# Altium schematic sheet 13 Processor Power Deco.SchDoc
size 420 x 297 mm
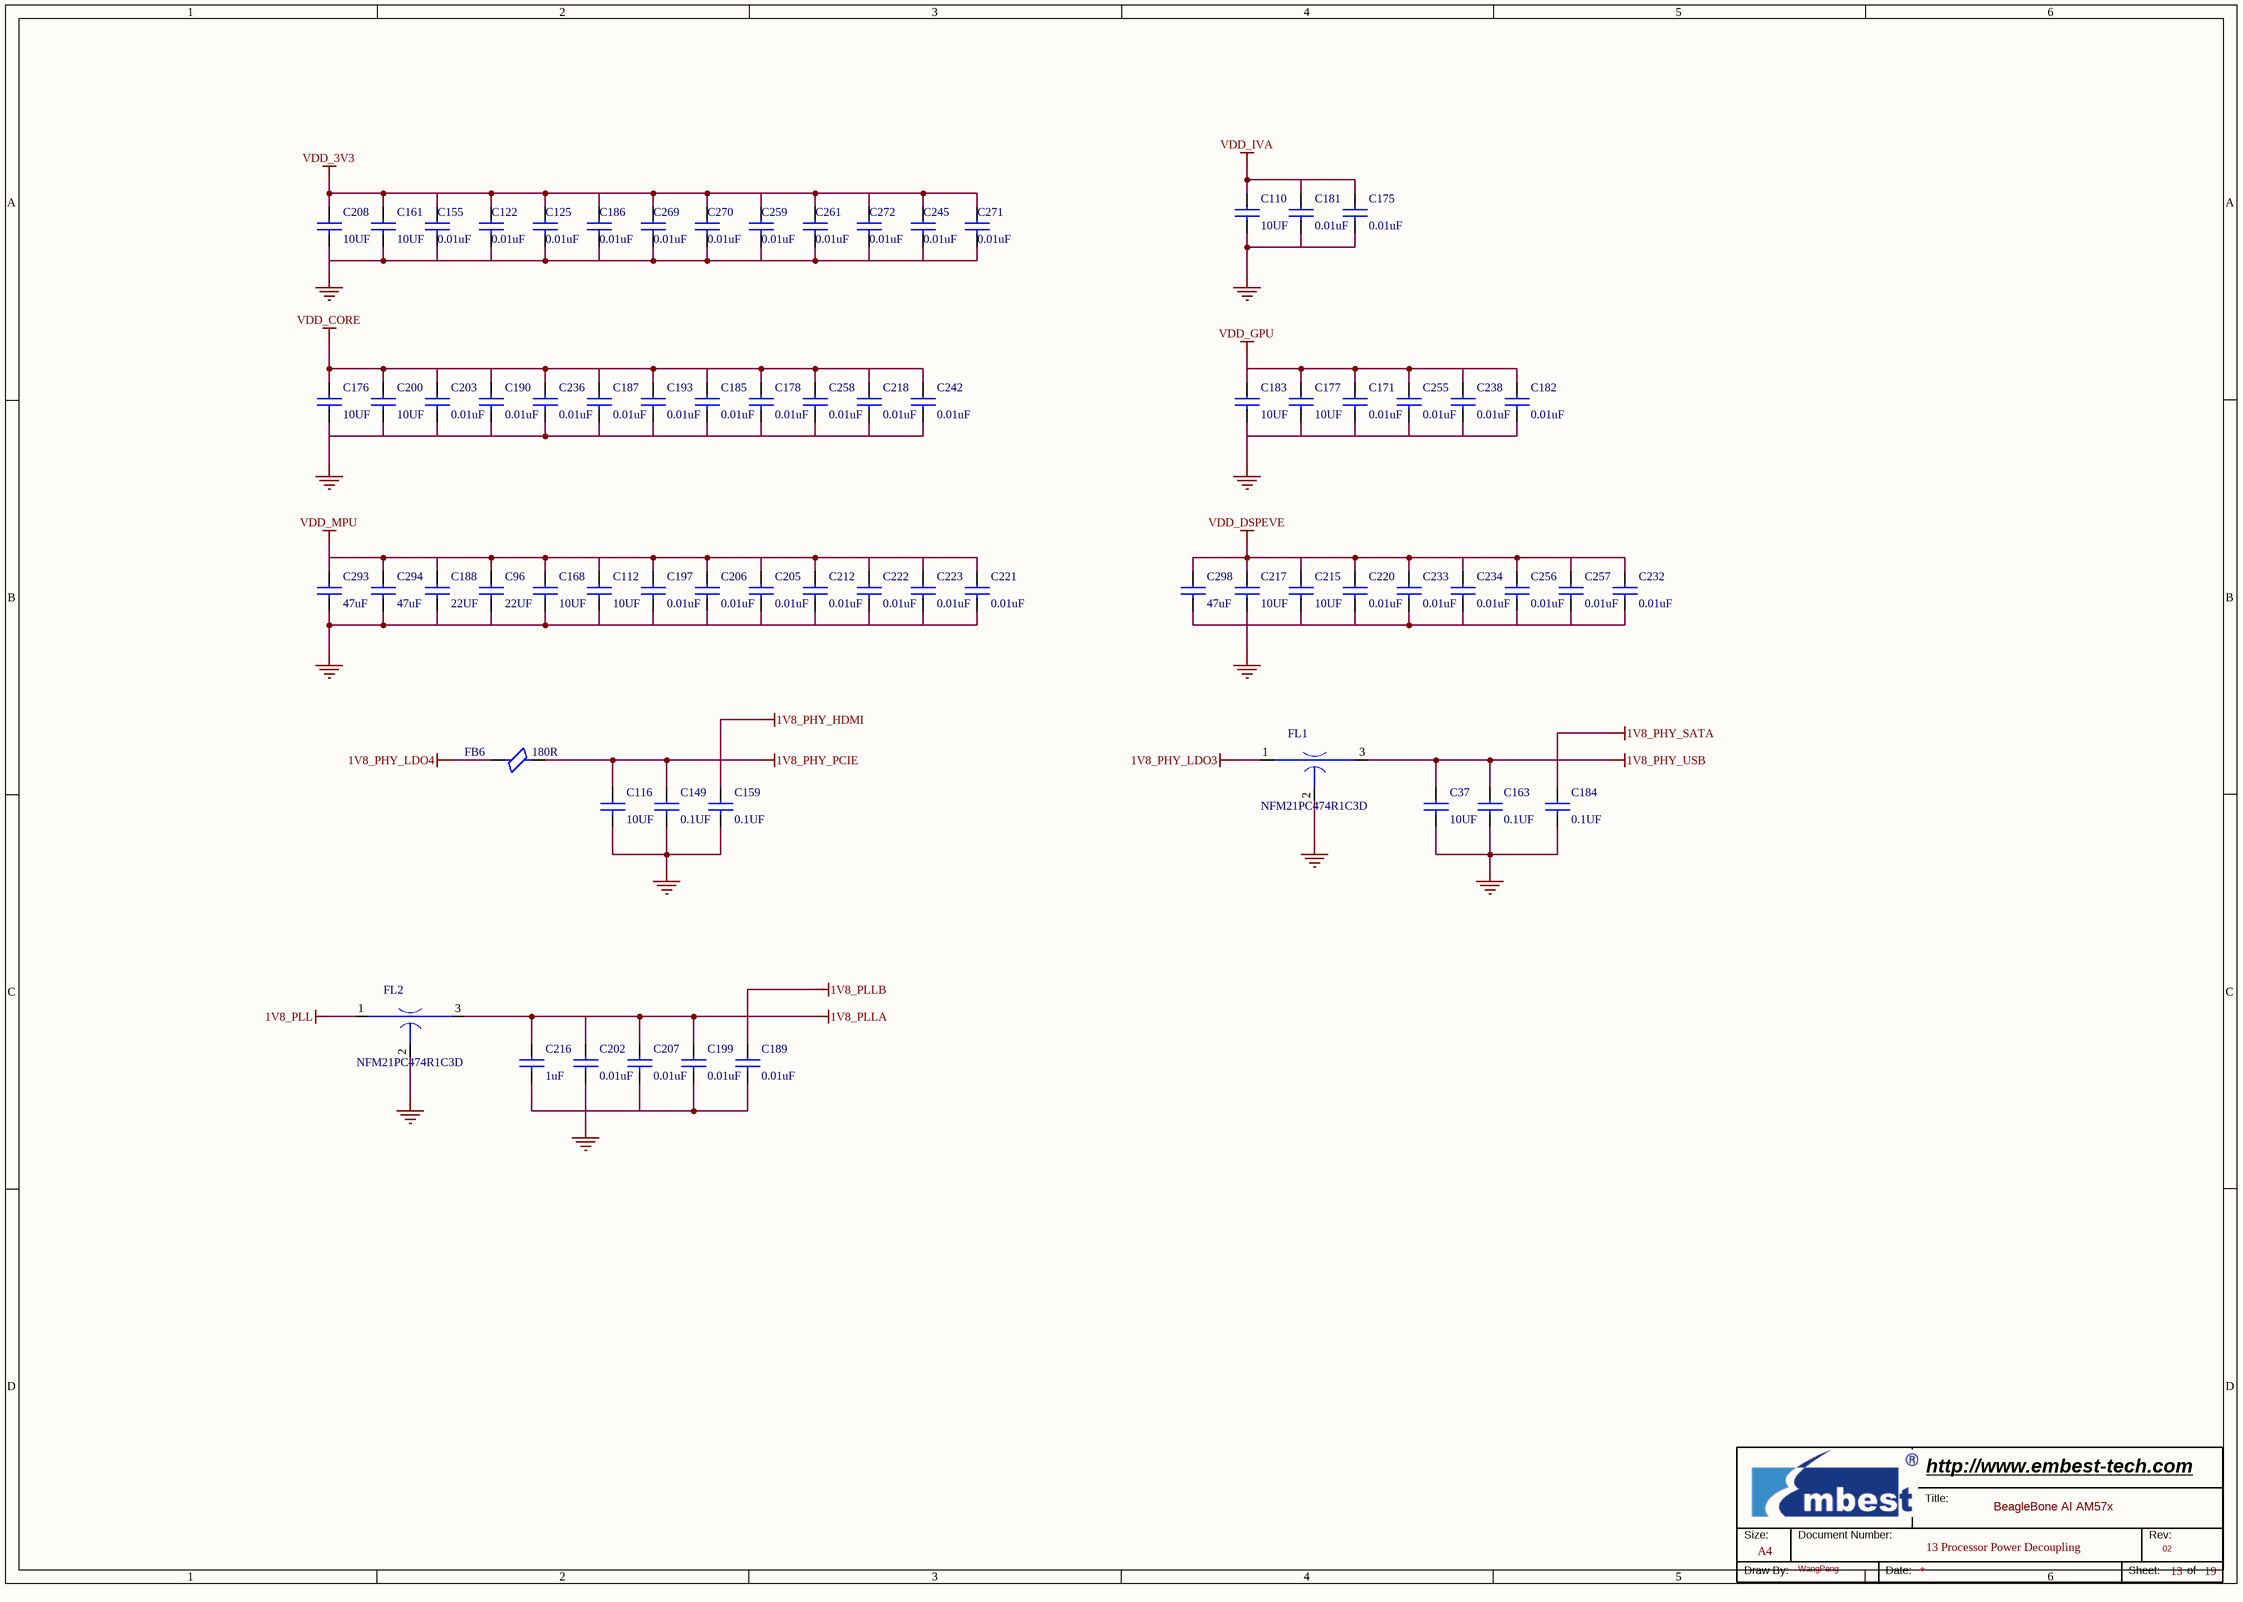
[diagram p0: 13 Processor Power Deco.SchDoc]

## Parts
*  Page Count: 19  Page Number: 13  Page Size: A4  Title: BeagleBone AI AM57x  RevCode: 02  Doc: 13 Processor Power Decoupling  Drawing: WangPeng  (hidden comment: Embest Title)  (graphical)
C37  10UF  [C0603]
C96  22UF  [C0603]
C110  10UF  [C0402]
C112  10UF  [C0402]
C116  10UF  [C0603]
C122  0.01uF  [C0402]
C125  0.01uF  [C0402]
C149  0.1UF  [C0402]
C155  0.01uF  [C0402]
C159  0.1UF  [C0402]
C161  10UF  [C0603]
C163  0.1UF  [C0402]
C168  10UF  [C0402]
C171  0.01uF  [C0402]
C175  0.01uF  [C0402]
C176  10UF  [C0402]
C177  10UF  [C0402]
C178  0.01uF  [C0402]
C181  0.01uF  [C0402]
C182  0.01uF  [C0402]
C183  10UF  [C0402]
C184  0.1UF  [C0402]
C185  0.01uF  [C0402]
C186  0.01uF  [C0402]
C187  0.01uF  [C0402]
C188  22UF  [C0603]
C189  0.01uF  [C0402]
C190  0.01uF  [C0402]
C193  0.01uF  [C0402]
C197  0.01uF  [C0402]
C199  0.01uF  [C0402]
C200  10UF  [C0402]
C202  0.01uF  [C0402]
C203  0.01uF  [C0402]
C205  0.01uF  [C0402]
C206  0.01uF  [C0402]
C207  0.01uF  [C0402]
C208  10UF  [C0603]
C212  0.01uF  [C0402]
C215  10UF  [C0402]
C216  1uF  [C0402]
C217  10UF  [C0402]
C218  0.01uF  [C0402]
C220  0.01uF  [C0402]
C221  0.01uF  [C0402]
C222  0.01uF  [C0402]
C223  0.01uF  [C0402]
C232  0.01uF  [C0402]
C233  0.01uF  [C0402]
C234  0.01uF  [C0402]
C236  0.01uF  [C0402]
C238  0.01uF  [C0402]
C242  0.01uF  [C0402]
C245  0.01uF  [C0402]
C255  0.01uF  [C0402]
C256  0.01uF  [C0402]
C257  0.01uF  [C0402]
C258  0.01uF  [C0402]
C259  0.01uF  [C0402]
C261  0.01uF  [C0402]
C269  0.01uF  [C0402]
C270  0.01uF  [C0402]
C271  0.01uF  [C0402]
C272  0.01uF  [C0402]
C293  47uF  [C0805]
C294  47uF  [C0805]
C298  47uF  [C0805]
FB6  180R  [L0603]
FL1  NFM21PC474R1C3D  [fl0805]
FL2  NFM21PC474R1C3D  [fl0805]

## Nets
1V8_PHY_HDMI: C159.1
1V8_PHY_LDO3: FL1.1
1V8_PHY_LDO4: FB6.1
1V8_PHY_PCIE: C116.1 C149.1 FB6.2
1V8_PHY_SATA: C184.1
1V8_PHY_USB: C37.1 C163.1 FL1.3
1V8_PLL: FL2.1
1V8_PLLA: C199.1 C202.1 C207.1 C216.1 FL2.3
1V8_PLLB: C189.1
GND: C37.2 C96.2 C110.2 C112.2 C116.2 C122.2 C125.2 C149.2 C155.2 C159.2 C161.2 C163.2 C168.2 C171.2 C175.2 C176.2 C177.2 C178.2 C181.2 C182.2 C183.2 C184.2 C185.2 C186.2 C187.2 C188.2 C190.2 C193.2 C197.2 C200.2 C202.2 C203.2 C205.2 C206.2 C208.2 C212.2 C217.2 C218.2 C221.2 C222.2 C223.2 C236.2 C238.2 C242.2 C245.2 C255.2 C258.2 C259.2 C261.2 C269.2 C270.2 C271.2 C272.2 C293.2 C294.2 FL1.2 FL2.2
VDD_3V3: C122.1 C125.1 C155.1 C161.1 C186.1 C208.1 C245.1 C259.1 C261.1 C269.1 C270.1 C271.1 C272.1
VDD_CORE: C176.1 C178.1 C185.1 C187.1 C190.1 C193.1 C200.1 C203.1 C218.1 C236.1 C242.1 C258.1
VDD_DSPEVE: C215.1 C217.1 C220.1 C232.1 C233.1 C234.1 C256.1 C257.1 C298.1
VDD_GPU: C171.1 C177.1 C182.1 C183.1 C238.1 C255.1
VDD_IVA: C110.1 C175.1 C181.1
VDD_MPU: C96.1 C112.1 C168.1 C188.1 C197.1 C205.1 C206.1 C212.1 C221.1 C222.1 C223.1 C293.1 C294.1
NetC189_2: C189.2 C199.2 C207.2 C216.2
NetC215_2: C215.2 C220.2 C232.2 C233.2 C234.2 C256.2 C257.2 C298.2

## Notes on the sheet
- (in symbol Embest Title) Title:; Size:; Document Number:; Rev:; Draw By:; Date:; Sheet:; of

## Library data of the parts
C37 C116 C161 = C: CAP,10UF,+/-10%,X5R,10V,SMD0603; Manufacturer Part Number: GRM188R61A106KE69D; Manufacturer: Murata; Embest PN: 1004001100129; Datasheet: Y:\ÐÂK3ÏµÍ³ÎïÁÏdatasheet\[1003_1004]capacitor-resistor µçÈÝ¡¢µç×è\1004001100129T2 C1608X5R1A106M.pdf; Part Type: Ceramic Capacitor
C96 C188 = C: CAP,22UF,+/-20%,X5R,6.3V,SMD0603; Manufacturer: MURATA; Manufacturer Part Number: GRM188R60J226MEA0D; Embest PN: 1004001100130; Part Type: Ceramic Capacitor
C110 C112 C177 C200 = C: CAP,10UF,+/-20%,X5R,6.3V,SMD0402; Manufacturer: Yageo; Manufacturer Part Number: CC0402MRX5R5BB106; Embest PN: 1004001100345; Part Type: Ceramic Capacitor
C122 C125 C175 C181 C185-C187 C190 C193 C199 C203 C205-C207 C212 C220 C221 C223 C232-C234 C236 C242 C245 C256 C257 C259 C261 C272 = C: CAP,10NF,+/-10%,X7R,16V,SMD0402; Manufacturer Part Number: GRM155R71C103KA01D; Manufacturer: MURATA; Embest PN: 1004001100039; Part Type: Ceramic Capacitor
C149 C159 C163 = C: CAP,100NF,+/-10%,X7R,16V,SMD0402; Manufacturer: Murata; Manufacturer Part Number: GRM155R71C104KA88D; Embest PN: 1004001100047; Part Type: Ceramic Capacitor; Datasheet: Y:\ÐÂK3ÏµÍ³ÎïÁÏdatasheet\[1003_1004]capacitor-resistor µçÈÝ¡¢µç×è\1004001100047-GRM155R71C104KA88D.pdf
C155 C171 C178 C182 C189 C197 C202 C218 C222 C238 C255 C258 C269-C271 = C: CAP,10NF,+/-10%,X7R,16V,SMD0402; Manufacturer: MURATA; Manufacturer Part Number: GRM155R71C103KA01D; Embest PN: 1004001100039; Part Type: Ceramic Capacitor
C168 C176 C183 C215 C217 = C: CAP,10UF,+/-20%,X5R,6.3V,SMD0402; Manufacturer Part Number: CC0402MRX5R5BB106; Manufacturer: Yageo; Embest PN: 1004001100345; Part Type: Ceramic Capacitor
C184 = C: CAP,100NF,+/-10%,X7R,16V,SMD0402; Manufacturer Part Number: GRM155R71C104KA88D; Manufacturer: Murata; Embest PN: 1004001100047; Datasheet: Y:\ÐÂK3ÏµÍ³ÎïÁÏdatasheet\[1003_1004]capacitor-resistor µçÈÝ¡¢µç×è\1004001100047-GRM155R71C104KA88D.pdf; Part Type: Ceramic Capacitor
C208 = C: CAP,10UF,+/-10%,X5R,10V,SMD0603; Manufacturer: Murata; Manufacturer Part Number: GRM188R61A106KE69D; Embest PN: 1004001100129; Part Type: Ceramic Capacitor; Datasheet: Y:\ÐÂK3ÏµÍ³ÎïÁÏdatasheet\[1003_1004]capacitor-resistor µçÈÝ¡¢µç×è\1004001100129T2 C1608X5R1A106M.pdf
C216 = C: CAP,1UF,+/-10%,X5R,16V,SMD0402; Manufacturer: Murata; Manufacturer Part Number: GRM155R61C105KA12D; Embest PN: 1004001100058; Part Type: Ceramic Capacitor
C293 C294 C298 = C: CAP,47UF,+/-20%,X5R,6.3V,SMD0805; Manufacturer Part Number: GRM21BR60J476ME15L; Manufacturer: MURATA; Embest PN: 1004001100164; Part Type: Ceramic Capacitor
FB6 = FB: Ferrite Bead,180ohm@100MHz,+/-25%,1500mA,0.09ohm,SMD0603; Manufacturer Part Number: BLM18PG181SN1D; Manufacturer: Murata; Embest PN: 1005005100012; Part Type: Ferrite Bead
FL1 FL2 = FL: CAP Feedthru 0.47UF 20% 16V 0805; Manufacturer: Murata; Embest PN: 1013002100020; Status: AM5728; Manufacturer Part Number: NFM21PC474R1C3D; Part Type: filter
* = Embest Title: Page Create Date: May 29, 2006; WebSite: http://www.embest-tech.com; Company: Embest; Page Modify Date: *